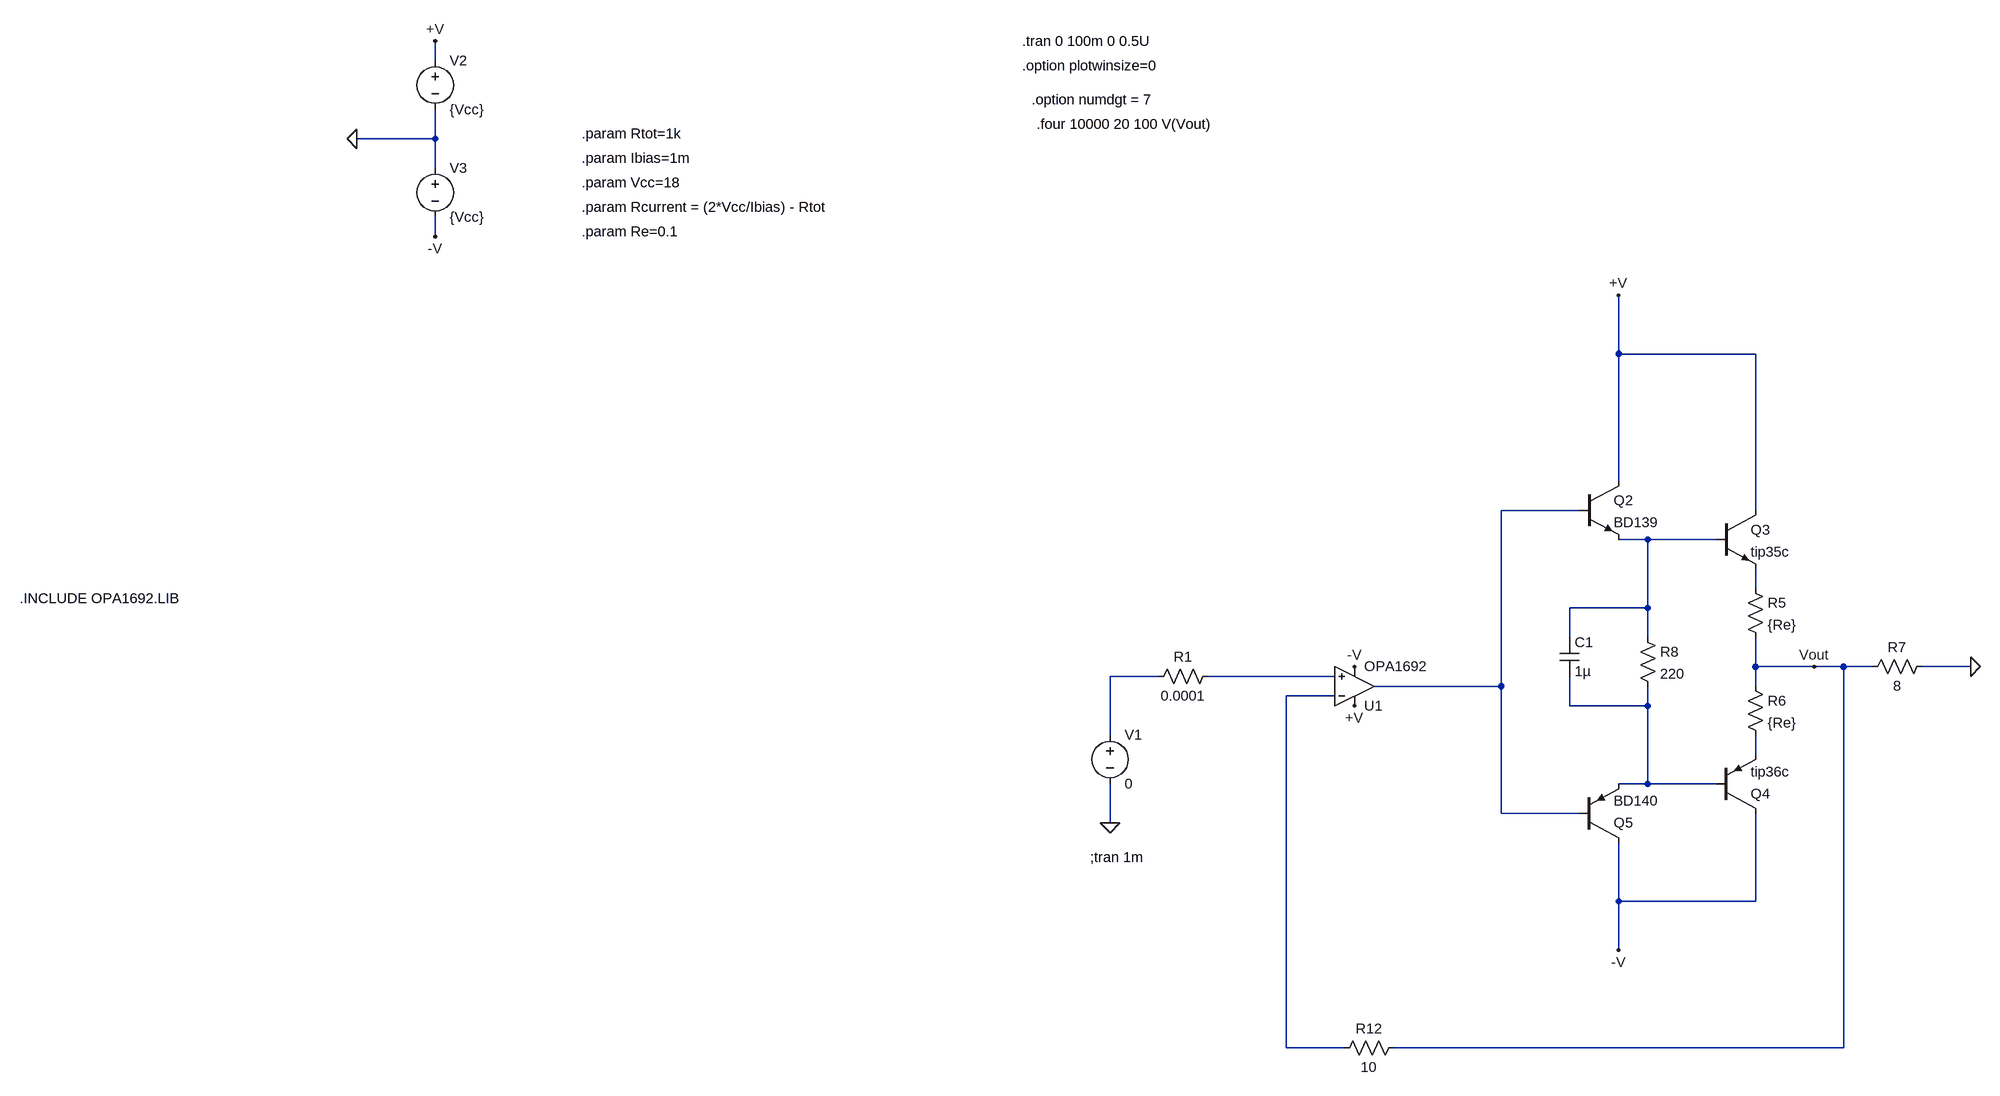
[diagram p0: schematic Direct drive.asc]
Direct drive.asc, the LTspice schematic file:
Version 4
SHEET 1 2020 1284
WIRE -512 -624 -512 -656
WIRE -512 -496 -512 -544
WIRE -512 -496 -640 -496
WIRE -512 -448 -512 -496
WIRE -512 -336 -512 -368
WIRE 1424 -144 1424 -240
WIRE 1648 -144 1424 -144
WIRE 1424 64 1424 -144
WIRE 1360 112 1232 112
WIRE 1648 112 1648 -144
WIRE 1472 160 1424 160
WIRE 1584 160 1472 160
WIRE 1648 240 1648 208
WIRE 1472 272 1472 160
WIRE 1472 272 1344 272
WIRE 1344 320 1344 272
WIRE 1472 320 1472 272
WIRE 1648 368 1648 320
WIRE 1744 368 1648 368
WIRE 1792 368 1744 368
WIRE 1840 368 1792 368
WIRE 2000 368 1920 368
WIRE 672 384 592 384
WIRE 960 384 752 384
WIRE 1232 400 1232 112
WIRE 1232 400 1024 400
WIRE 1648 400 1648 368
WIRE 960 416 880 416
WIRE 1344 432 1344 384
WIRE 1472 432 1472 400
WIRE 1472 432 1344 432
WIRE 592 480 592 384
WIRE 1648 512 1648 480
WIRE 1472 560 1472 432
WIRE 1472 560 1424 560
WIRE 1584 560 1472 560
WIRE 1232 608 1232 400
WIRE 1360 608 1232 608
WIRE 592 624 592 560
WIRE 1424 752 1424 656
WIRE 1648 752 1648 608
WIRE 1648 752 1424 752
WIRE 1424 832 1424 752
WIRE 880 992 880 416
WIRE 976 992 880 992
WIRE 1792 992 1792 368
WIRE 1792 992 1056 992
FLAG 1424 -240 +V
FLAG 1424 832 -V
FLAG 592 624 0
FLAG -640 -496 0
FLAG -512 -656 +V
FLAG -512 -336 -V
FLAG 2000 368 0
FLAG 1744 368 Vout
FLAG 992 432 +V
FLAG 992 368 -V
SYMBOL voltage 592 464 R0
WINDOW 123 0 0 Left 0
WINDOW 39 0 0 Left 0
SYMATTR InstName V1
SYMATTR Value 0
SYMBOL res 768 368 R90
WINDOW 0 0 56 VBottom 2
WINDOW 3 32 56 VTop 2
SYMATTR InstName R1
SYMATTR Value 0.0001
SYMBOL npn 1360 64 R0
SYMATTR InstName Q2
SYMATTR Value BD139
SYMBOL npn 1584 112 R0
SYMATTR InstName Q3
SYMATTR Value tip35c
SYMBOL pnp 1584 608 M180
SYMATTR InstName Q4
SYMATTR Value tip36c
SYMBOL pnp 1360 656 M180
SYMATTR InstName Q5
SYMATTR Value BD140
SYMBOL res 1632 224 R0
SYMATTR InstName R5
SYMATTR Value {Re}
SYMBOL res 1632 384 R0
SYMATTR InstName R6
SYMATTR Value {Re}
SYMBOL voltage -512 -640 R0
WINDOW 123 0 0 Left 0
WINDOW 39 0 0 Left 0
SYMATTR InstName V2
SYMATTR Value {Vcc}
SYMBOL voltage -512 -464 R0
WINDOW 123 0 0 Left 0
WINDOW 39 0 0 Left 0
SYMATTR InstName V3
SYMATTR Value {Vcc}
SYMBOL res 1936 352 R90
WINDOW 0 0 56 VBottom 2
WINDOW 3 32 56 VTop 2
SYMATTR InstName R7
SYMATTR Value 8
SYMBOL res 1456 304 R0
SYMATTR InstName R8
SYMATTR Value 220
SYMBOL cap 1328 320 R0
SYMATTR InstName C1
SYMATTR Value 1µ
SYMBOL OpAmps\\opamp2 992 464 M180
SYMATTR InstName U1
SYMATTR Value OPA1692
SYMBOL res 1072 976 R90
WINDOW 0 0 56 VBottom 2
WINDOW 3 32 56 VTop 2
SYMATTR InstName R12
SYMATTR Value 10
TEXT -272 -504 Left 2 !.param Rtot=1k
TEXT -272 -464 Left 2 !.param Ibias=1m
TEXT -272 -424 Left 2 !.param Vcc=18
TEXT -272 -384 Left 2 !.param Rcurrent = (2*Vcc/Ibias) - Rtot
TEXT -272 -344 Left 2 !.param Re=0.1
TEXT 560 680 Left 2 !;tran 1m
TEXT 448 -656 Left 2 !.tran 0 100m 0 0.5U
TEXT 448 -616 Left 2 !.option plotwinsize=0
TEXT 464 -560 Left 2 !.option numdgt = 7
TEXT 472 -520 Left 2 !.four 10000 20 100 V(Vout)
TEXT -1192 256 Left 2 !.INCLUDE OPA1692.LIB

The netlist it stands for:
* Direct drive.asc
V1 N004 0 0
R1 N005 N004 0.0001
Q2 +V N001 N002 0 BD139
Q3 +V N002 N003 0 tip35c
Q4 -V N007 N008 0 tip36c
Q5 -V N001 N007 0 BD140
R5 N003 Vout {Re}
R6 Vout N008 {Re}
V2 +V 0 {Vcc}
V3 0 -V {Vcc}
R7 0 Vout 8
R8 N002 N007 220
C1 N002 N007 1µ
XU1 N005 N006 +V -V N001 OPA1692  ; pins In+ In- V+ V- OUT
R12 Vout N006 10
.model NPN NPN
.model PNP PNP
.lib standard.bjt
.param Rtot=1k
.param Ibias=1m
.param Vcc=18
.param Rcurrent = (2*Vcc/Ibias) - Rtot
.param Re=0.1
;tran 1m
.tran 0 100m 0 0.5U
.option plotwinsize=0
.option numdgt = 7
.four 10000 20 100 V(Vout)
.INCLUDE OPA1692.LIB
.backanno
.end